# EasyEDA Pro project ProProject_WotageiStick.epro

# Schematic Schematic1
Create Date: 2023-12-16; Page Name: P1; Project Name: WotageiStick; Schematic Name: Schematic1; Update Date: 2024-01-03; Company: 嘉立创EDA; Page Size: A3; Version: V1.0
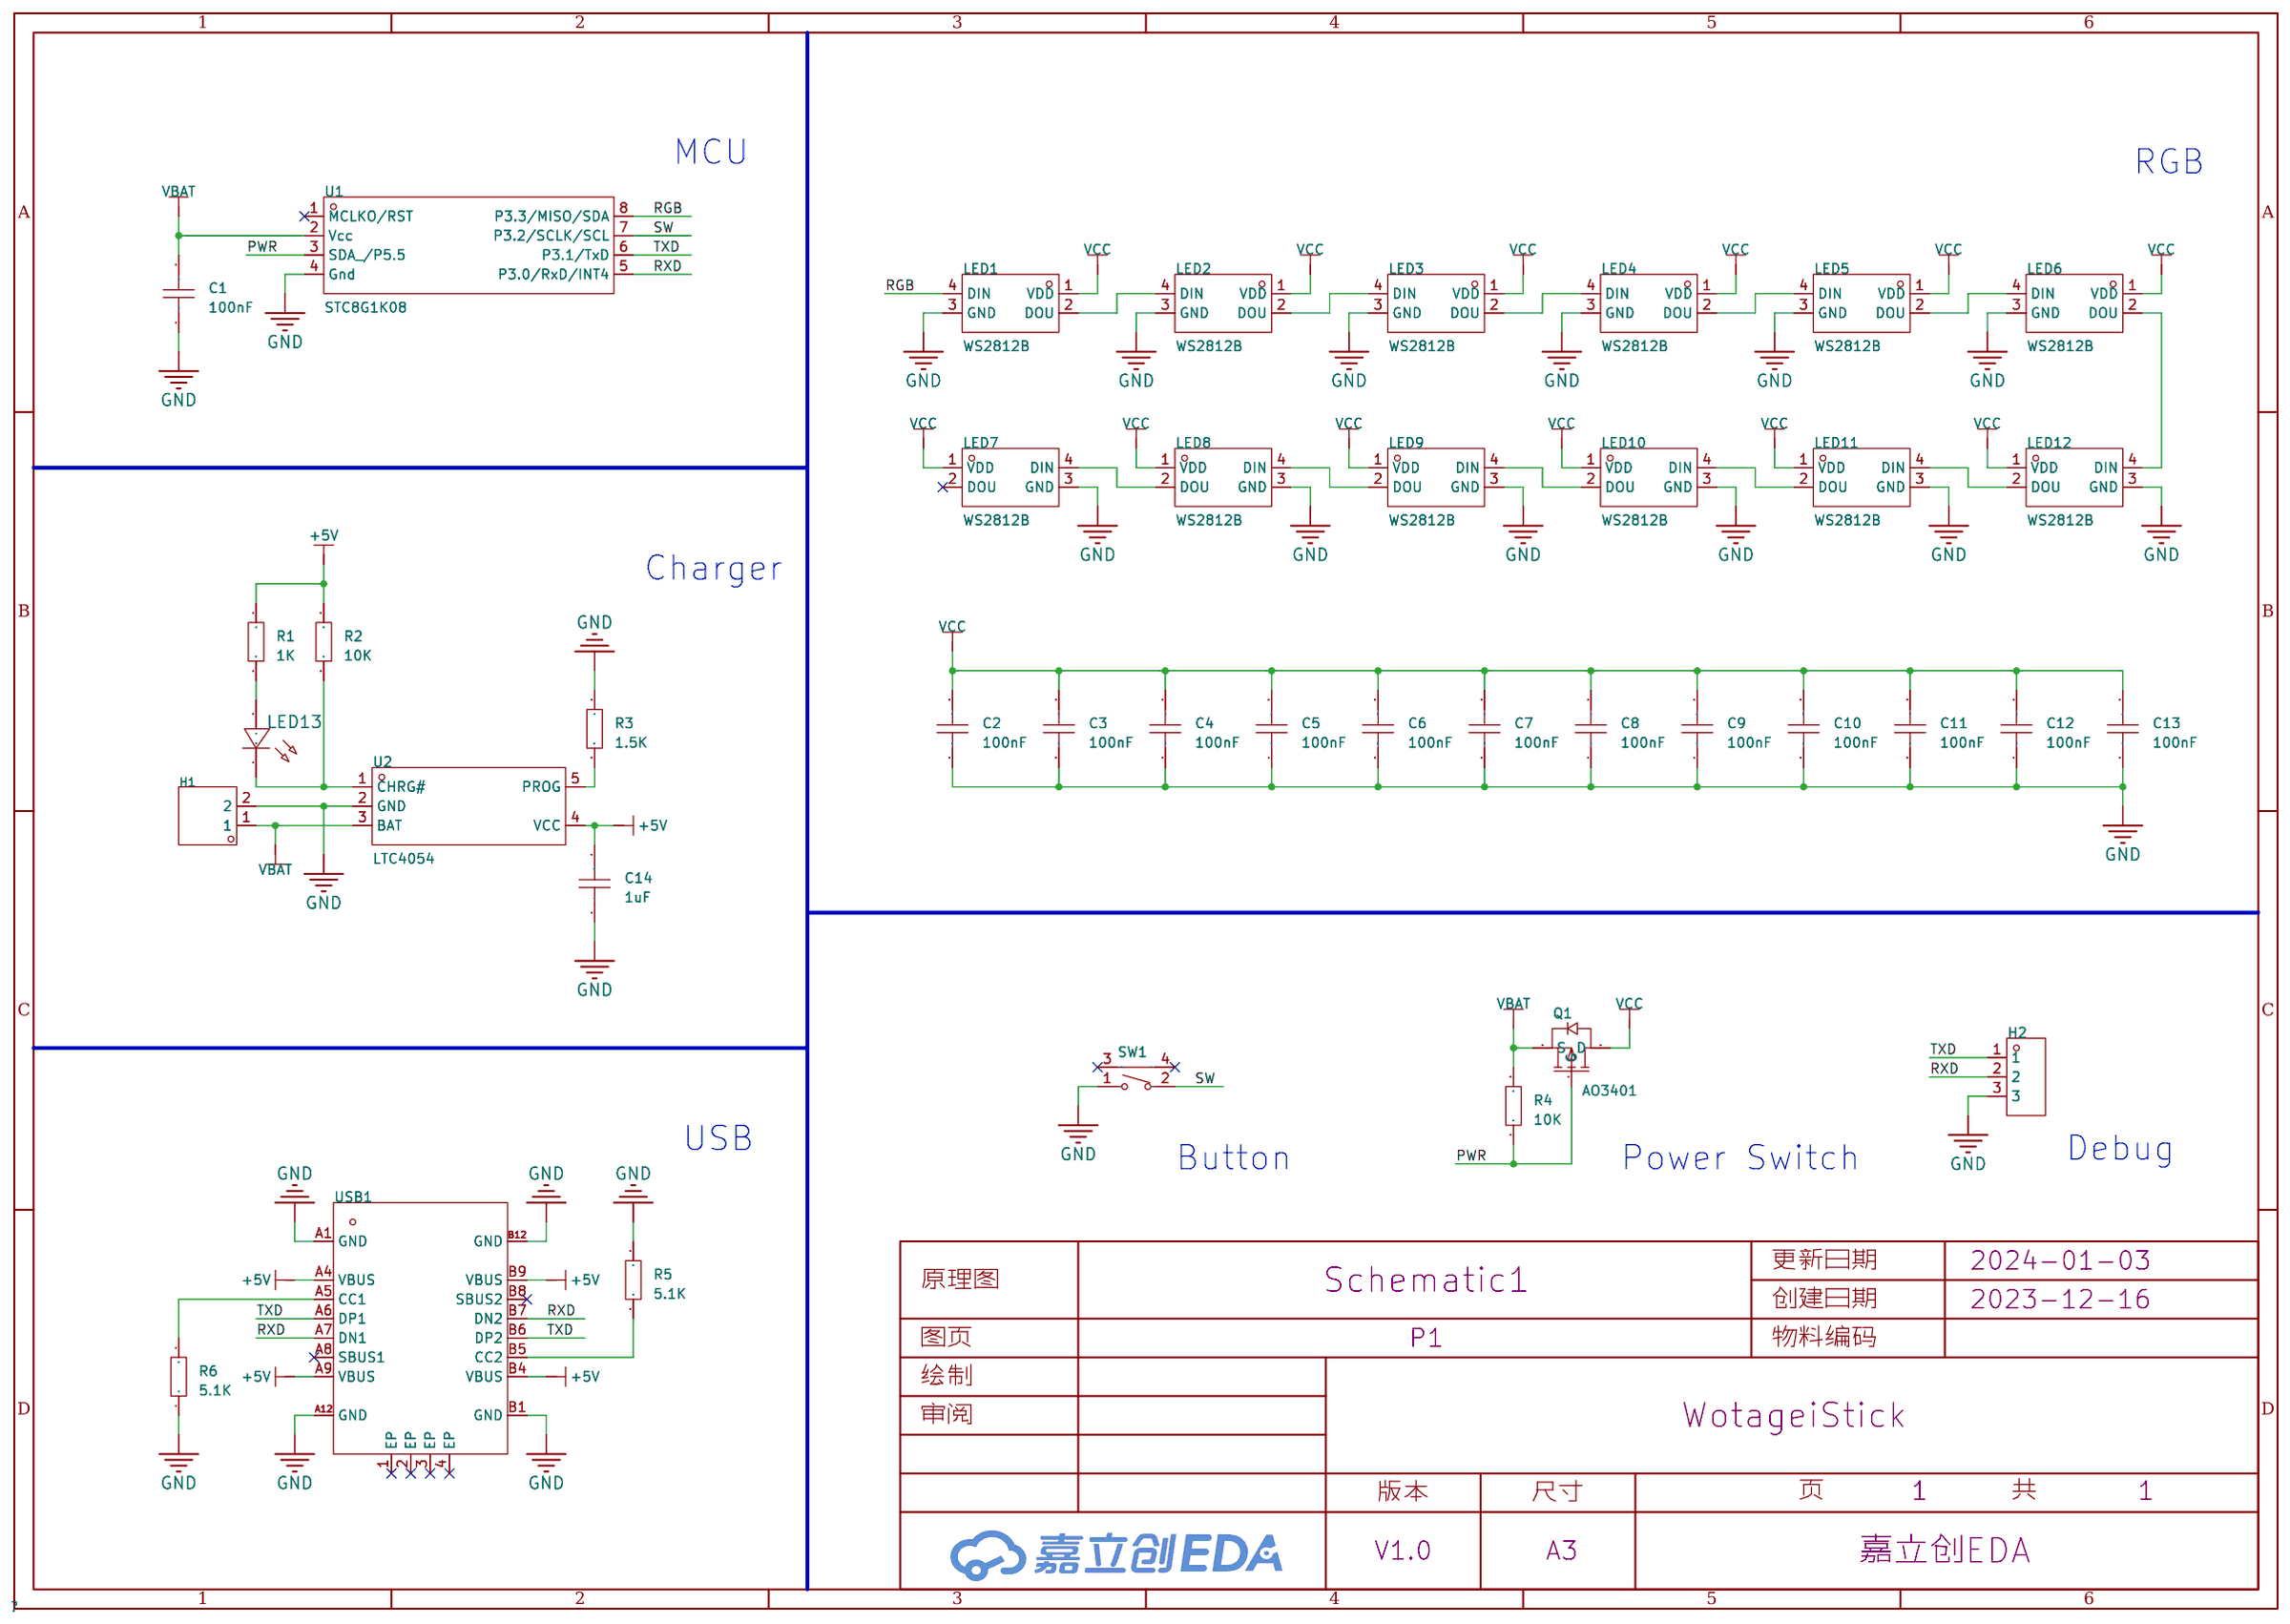
[diagram p0: schematic sheet]

## Parts
C1  100nF  [C0603]
C2  100nF  [C0603]
C3  100nF  [C0603]
C4  100nF  [C0603]
C5  100nF  [C0603]
C6  100nF  [C0603]
C7  100nF  [C0603]
C8  100nF  [C0603]
C9  100nF  [C0603]
C10  100nF  [C0603]
C11  100nF  [C0603]
C12  100nF  [C0603]
C13  100nF  [C0603]
C14  1uF  [C0603]
H1  -  [HDR-TH_2P-P2.54-V-M-1]
H2  -  [HDR-TH_3P-P2.54-V-M]
LED1  WS2812B  [LED-SMD_4P-L5.0-W5.0-BL_XL-5050RGBC]
LED2  WS2812B  [LED-SMD_4P-L5.0-W5.0-BL_XL-5050RGBC]
LED3  WS2812B  [LED-SMD_4P-L5.0-W5.0-BL_XL-5050RGBC]
LED4  WS2812B  [LED-SMD_4P-L5.0-W5.0-BL_XL-5050RGBC]
LED5  WS2812B  [LED-SMD_4P-L5.0-W5.0-BL_XL-5050RGBC]
LED6  WS2812B  [LED-SMD_4P-L5.0-W5.0-BL_XL-5050RGBC]
LED7  WS2812B  [LED-SMD_4P-L5.0-W5.0-BL_XL-5050RGBC]
LED8  WS2812B  [LED-SMD_4P-L5.0-W5.0-BL_XL-5050RGBC]
LED9  WS2812B  [LED-SMD_4P-L5.0-W5.0-BL_XL-5050RGBC]
LED10  WS2812B  [LED-SMD_4P-L5.0-W5.0-BL_XL-5050RGBC]
LED11  WS2812B  [LED-SMD_4P-L5.0-W5.0-BL_XL-5050RGBC]
LED12  WS2812B  [LED-SMD_4P-L5.0-W5.0-BL_XL-5050RGBC]
LED13  -  [LED_0603]
Q1  AO3401  [AO3401A_SOT-23-3]
R1  1K  [R0603]
R2  10K  [R0603]
R3  1.5K  [R0603]
R4  10K  [R0603]
R5  5.1K  [R0603]
R6  5.1K  [R0603]
SW1  TS-KG86E-ACT35F  [SW-SMD_TS-KG86EV-ART35]
U1  STC8G1K08  [SOP-8_L5.0-W4.0-P1.27-LS6.0-BL]
U2  LTC4054  [SOT-23-5_L3.0-W1.7-P0.95-LS2.8-BL]
USB1  -  [USB_TYPE-C-16P]

## Library data of the parts
C1-C14 = CAP_0603: Supplier Footprint: 0603
H1 = HDR-M_2.54_1x2P: Supplier Part: C124375; Supplier Footprint: 插件
H2 = HDR-M_2.54_1x3P: Supplier Part: C2937625; Supplier Footprint: 插件
LED1-LED12 = XL-5050RGBC-WS2812B: 发光颜色:RGB三色;二极管配置:-;功率:-;透镜颜色:无色透明透镜;主波长:-;色温:-;发光角度:120°;安装方式:正贴;工作温度:-30℃~+70℃;; LCSC Part Name: RGB三色 正贴 幻彩; Supplier Part: C2843785; Manufacturer: XINGLIGHT(成兴光); Supplier Footprint: SMD5050; JLCPCB Part Class: 扩展库; Datasheet: https://atta.szlcsc.com/upload/public/pdf/source/20230111/86AAD2096485A2E5BCAB883FF8CBE6FD.pdf; Supplier: LCSC; Emitted Color: RGB三色; Lens Color: 无色透明透镜; Peak Wavelength: 625nm；470nm；530nm; Viewing Angle: 120°; Mounting Sytle: 正贴; Operating Temperature: -30℃~+70℃
LED13 = LED_0603-R: Supplier Footprint: 0603
Q1 = AO3401A_P: Supplier Footprint: SOT-23-3L; Supplier Part: C15127
R1-R6 = Res_0603: Supplier Footprint: 0603
SW1 = TS-KG86E-ACT35F: 触点电流:50mA;额定电压(DC):12V;绝缘电阻:100MΩ;机械寿命:-;; LCSC Part Name: 侧按轻触开关2*4*3.5 迷你小型贴片按键开关; Supplier Part: C2874419; Manufacturer: HANBO(汉博); JLCPCB Part Class: 扩展库; Datasheet: https://atta.szlcsc.com/upload/public/pdf/source/20221110/7C8A71DCCE0191ED5ADB1ED6693AEFDE.pdf; Supplier: LCSC; Contact Current: 50mA; Voltage Rating (DC): 12V; Insulation Resistance: 100MΩ
U1 = STC8G1K08-36I-SOP8: CPU内核:51系列;CPU最大主频:-;程序存储容量:8KB;程序存储器类型:FLASH;GPIO端口数量:6;工作电压范围:1.9V~5.5V;RAM总容量:1.25KB;; Supplier Part: C713818; Manufacturer: STC(宏晶); Supplier Footprint: SOP-8; JLCPCB Part Class: 扩展库; Datasheet: https://atta.szlcsc.com/upload/public/pdf/source/20230914/7707908C45C6343AE73767C1466DDB8D.pdf; Supplier: LCSC; CPU Core: 51系列; Program Storage Size: 8KB; Program Memory Type: FLASH; GPIO Ports Number: 6; Operating Voltage Range: 1.9V~5.5V; RAM Size: 1.25KB; Operating Temperature Range: -40℃~+85℃; 16Bit Timer: 2; UART/USART: 1; I2C: 1; SPI: 1; Peripheral/Function: 低电压检测；看门狗；除法器；乘法器; Watchdog: 有; Low-Voltage Detect: 有; Internal Oscillator: 有
U2 = LTC4054ES5-4.2#PBF: 具有热调节功能的独立线性锂离子电池充电器; Supplier Part: C117064; Manufacturer: ADI(亚德诺)/LINEAR(凌特); Supplier Footprint: SOT-23-5; JLCPCB Part Class: 扩展库; Datasheet: https://atta.szlcsc.com/upload/public/pdf/source/20170712/C117064_1499832277334814248.pdf; Supplier: LCSC
USB1 = USB_TYPE-C-16P: Supplier Footprint: SMD

## Nets
+5V: C14.2 R1.1 R2.1 U2.4(VCC) USB1.A4(VBUS) USB1.A9(VBUS) USB1.B4(VBUS) USB1.B9(VBUS)
GND: C1.1 C2.1 C3.1 C4.1 C5.1 C6.1 C7.1 C8.1 C9.1 C10.1 C11.1 C12.1 C13.1 C14.1 H1.2 H2.3 LED1.3(GND) LED2.3(GND) LED3.3(GND) LED4.3(GND) LED5.3(GND) LED6.3(GND) LED7.3(GND) LED8.3(GND) LED9.3(GND) LED10.3(GND) LED11.3(GND) LED12.3(GND) R3.1 R5.1 R6.1 SW1.1 U1.4(Gnd) U2.2(GND) USB1.A1(GND) USB1.A12(GND) USB1.B1(GND) USB1.B12(GND)
VBAT: C1.2 H1.1 Q1.2(S) R4.2 U1.2(Vcc) U2.3(BAT)
VCC: C2.2 C3.2 C4.2 C5.2 C6.2 C7.2 C8.2 C9.2 C10.2 C11.2 C12.2 C13.2 LED1.1(VDD) LED2.1(VDD) LED3.1(VDD) LED4.1(VDD) LED5.1(VDD) LED6.1(VDD) LED7.1(VDD) LED8.1(VDD) LED9.1(VDD) LED10.1(VDD) LED11.1(VDD) LED12.1(VDD) Q1.3(D)
PWR: Q1.1(G) R4.1 U1.3(SDA_/P5.5)
RGB: LED1.4(DIN) U1.8(P3.3/MISO/SDA)
RXD: H2.2 U1.5(P3.0/RxD/INT4) USB1.A7(DN1) USB1.B7(DN2)
SW: SW1.2 U1.7(P3.2/SCLK/SCL)
TXD: H2.1 U1.6(P3.1/TxD) USB1.A6(DP1) USB1.B6(DP2)
$1N498: R3.2 U2.5(PROG)
$1N559: LED13.2(A) R1.2
$1N577: LED13.1(C) R2.2 U2.1(CHRG#)
$1N1367: LED4.2(DOU) LED5.4(DIN)
$1N1526: LED2.2(DOU) LED3.4(DIN)
$1N1539: LED3.2(DOU) LED4.4(DIN)
$1N1823: LED8.4(DIN) LED9.2(DOU)
$1N1839: LED10.4(DIN) LED11.2(DOU)
$1N1846: LED9.4(DIN) LED10.2(DOU)
$1N1960: LED1.2(DOU) LED2.4(DIN)
$1N2043: LED7.4(DIN) LED8.2(DOU)
$1N3699: R6.2 USB1.A5(CC1)
$1N3708: R5.2 USB1.B5(CC2)
$1N6521: LED5.2(DOU) LED6.4(DIN)
$1N6607: LED6.2(DOU) LED12.4(DIN)
$1N6709: LED11.4(DIN) LED12.2(DOU)

Not connected (* = marked no-connect by the designer): LED7 2(DOU)*; SW1 3* 4*; U1 1(MCLKO/RST)*; USB1 1(EP)* 2(EP)* 3(EP)* 4(EP)* A8(SBUS1)* B8(SBUS2)*

## Notes on the sheet
- MCU
- RGB
- Charger
- USB
- Debug
- Button
- Power Switch

# Schematic Schematic2
Create Date: 2023-12-17; Page Name: P1; Project Name: WotageiStick; Schematic Name: Schematic2; Update Date: 2023-12-18; Company: 嘉立创EDA; Page Size: A3; Version: V1.0
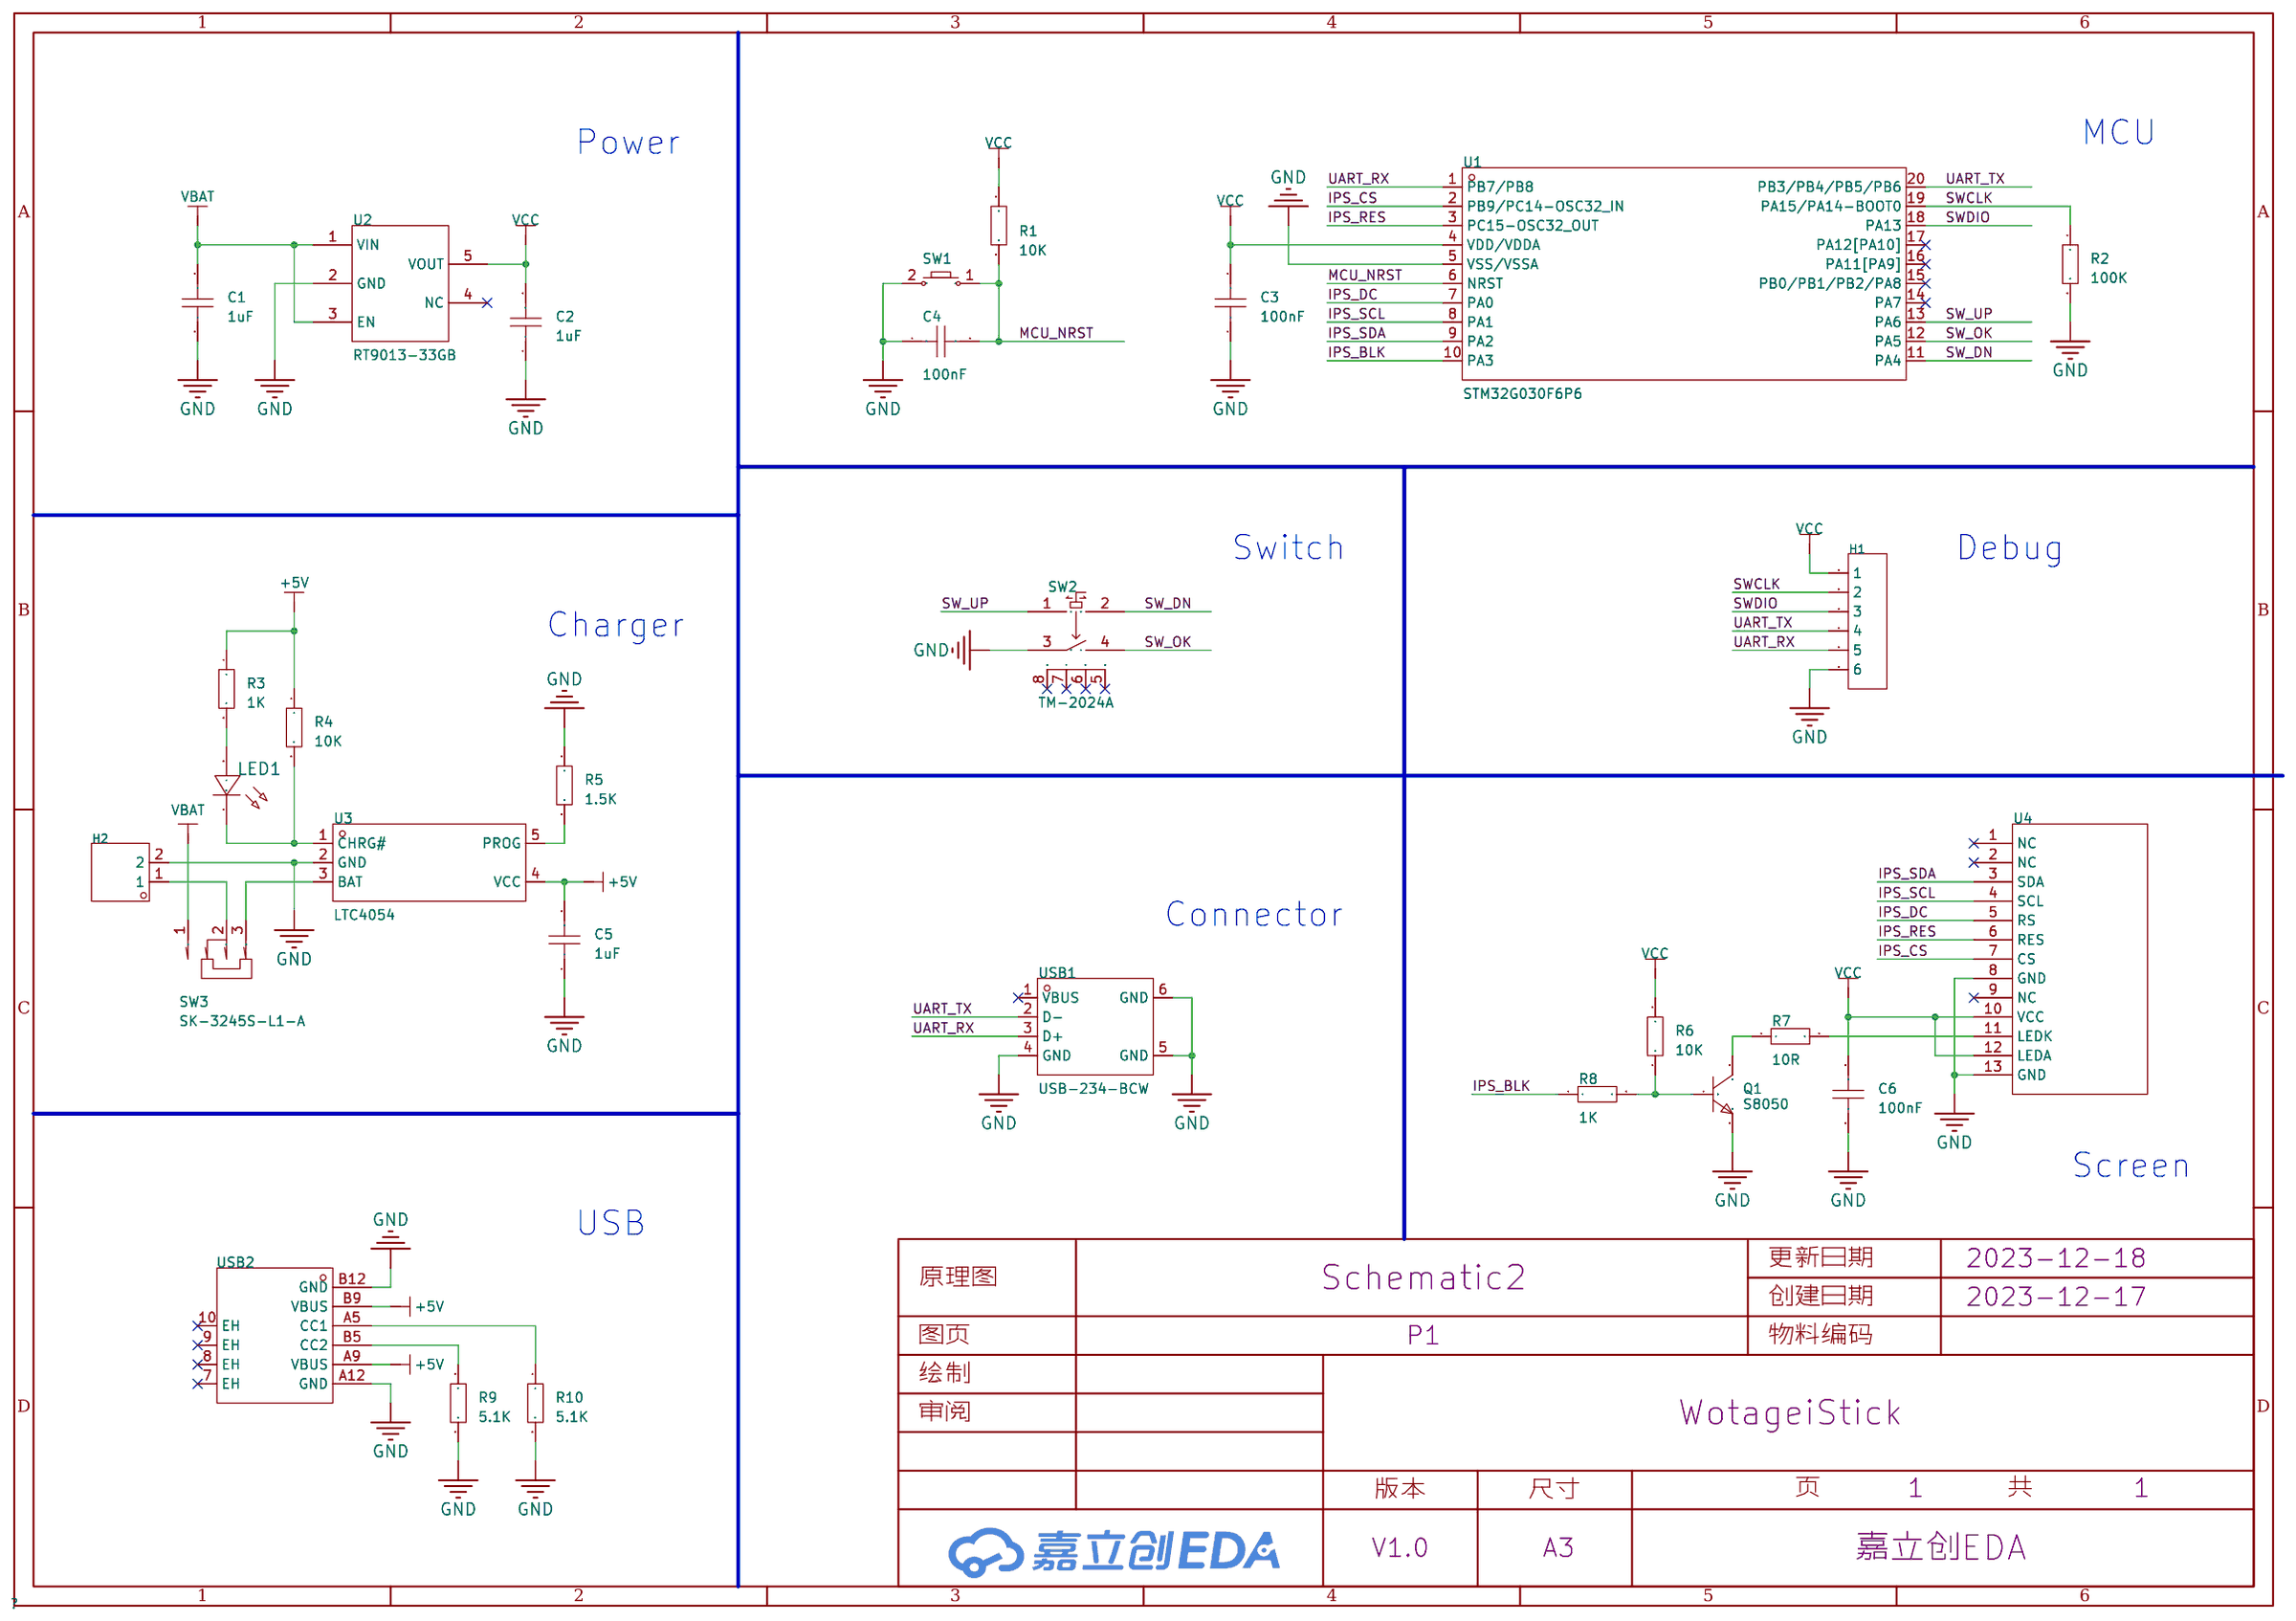
[diagram p1: schematic sheet]

## Parts
C1  1uF  [C0603]
C2  1uF  [C0603]
C3  100nF  [C0603]
C4  100nF  [C0603]
C5  1uF  [C0603]
C6  100nF  [C0603]
H1  -  [HDR-TH_6P-P2.54-V-M-1]
H2  -  [HDR-TH_2P-P2.54-V-M-1]
LED1  -  [LED_0603]
Q1  S8050  [SOT-23-3_L2.9-W1.3-P1.90-LS2.4-BR]
R1  10K  [R0603]
R2  100K  [R0603]
R3  1K  [R0603]
R4  10K  [R0603]
R5  1.5K  [R0603]
R6  10K  [R0603]
R7  10R  [R0603]
R8  1K  [R0603]
R9  5.1K  [R0603]
R10  5.1K  [R0603]
SW1  -  [Key_SMD_3x4x2]
SW2  TM-2024A  [SW-SMD_TM-2024A]
SW3  SK-3245S-L1-A  [SW-SMD_SK-3245S-L1-A-1]
U1  STM32G030F6P6  [TSSOP-20_L6.5-W4.4-P0.65-LS6.4-BL]
U2  RT9013-33GB  [SOT-23-5_L3.0-W1.7-P0.95-LS2.8-BL]
U3  LTC4054  [SOT-23-5_L3.0-W1.7-P0.95-LS2.8-BL]
U4  -  [N096-1608TBBIG11-H13]
USB1  USB-234-BCW  [USB-A-SMD_USB-234-BCW]
USB2  -  [USB_ TYPE-C-6P]

## Library data of the parts
C1-C6 = CAP_0603: Supplier Footprint: 0603
H1 = HDR-M_2.54_1x6P: Supplier Part: C37208; Supplier Footprint: 插件
H2 = HDR-M_2.54_1x2P: Supplier Part: C124375; Supplier Footprint: 插件
LED1 = LED_0603-R: Supplier Footprint: 0603
Q1 = S8050_C2891804: 晶体管类型:NPN;集电极电流(Ic):500mA;集射极击穿电压(Vceo):25V;功率(Pd):300mW;; LCSC Part Name: 耐压:25V 电流:500mA NPN; Supplier Part: C2891804; Manufacturer: YONGYUTAI(永裕泰); Supplier Footprint: SOT-23; JLCPCB Part Class: Extended Part; Datasheet: https://atta.szlcsc.com/upload/public/pdf/source/20210901/5347316A10609C628D4D69AE01446E5B.pdf; Supplier: LCSC; Transistor Type: NPN; Collector Current (Ic): 500mA; Collector-Emitter Breakdown Voltage (Vceo): 25V; Power Dissipation (Pd): 300mW; Collector Cut-Off Current (Icbo): 1uA; Collector-Emitter Saturation Voltage (VCE(sat)@Ic,Ib): 500mV@500mA,50mA; Operating Temperature: +150℃@(Tj)
R1-R10 = Res_0603: Supplier Footprint: 0603
SW1 = Key_SMD_3x4x2: Supplier Footprint: SMD
SW2 = TM-2024A: LCSC Part Name: 四脚两档拨轮开关TM-2024A; Supplier Part: C561480; Manufacturer: XKB Connectivity(中国星坤); Supplier Footprint: SMD; JLCPCB Part Class: 扩展库; Datasheet: https://atta.szlcsc.com/upload/public/pdf/source/20211011/7A4DB3DC37E7D5823B6D92C66ED3191E.pdf; Supplier: LCSC
SW3 = SK-3245S-L1-A: 电路结构:双刀双掷;安装方式:卧贴;开关颜色:黑色;额定电流(DC):50mA;额定电压(DC):12V;额定电流(AC):50mA;额定电压(AC):12V;机械寿命:1万次;; LCSC Part Name: 柄长2mm 卧贴双档 滑动开关; Supplier Part: C405951; Manufacturer: XKB Connectivity(中国星坤); Supplier Footprint: SMD; JLCPCB Part Class: 扩展库; Datasheet: https://atta.szlcsc.com/upload/public/pdf/source/20200227/C405951_CBAB505F81ACCB08512C6DA919ADD92C.pdf; Supplier: LCSC; Circuit: 双刀双掷; Actuator Style: 矩形柱状; Pin Style: SMD接片; Switch Length: 9.1mm; Switch Width: 3.55mm; Switch Height: 3.2mm; Mounting Style: 卧贴; Actuator Color: 黑色; Current Rating (DC): 50mA; Voltage Rating (DC): 12V; Current Rating (AC): 50mA; Voltage Rating (AC): 12V; Mechanical Life: 1万次; Operating Temperature: -40℃~+85℃
U1 = STM32G030F6P6: Supplier Part: C724040; Manufacturer: ST(意法半导体); Supplier Footprint: TSSOP-20; JLCPCB Part Class: 扩展库; Datasheet: https://atta.szlcsc.com/upload/public/pdf/source/20200511/C529329_A1CB615556C746C4EA827FCAD1461480.pdf; Supplier: LCSC
U2 = RT9013-33GB: 输出类型:固定;输出极性:正;最大输入电压:5.5V;输出电压:3.3V;输出电流:500mA;电源纹波抑制比(PSRR):50dB@(10kHz);; LCSC Part Name: 输入5.5V 输出3.3V 500mA; Supplier Part: C47773; Manufacturer: RICHTEK(立锜); Supplier Footprint: SOT-23-5; JLCPCB Part Class: 扩展库; Datasheet: https://atta.szlcsc.com/upload/public/pdf/source/20150504/1457707282459.pdf; Supplier: LCSC; Output Type: 固定; Output Polarity: 正; Number of Outputs: 1; Maximum Input Voltage: 5.5V; Output Voltage: 3.3V; Dropout Voltage: 400mV@(500mA); Quiescent Current (Ground Current): 50uA; Output Current: 500mA; Power Supply Rejection Ratio (PSRR): 50dB@(10kHz); Operating Temperature: -40℃~+85℃
U3 = LTC4054ES5-4.2#PBF: 具有热调节功能的独立线性锂离子电池充电器; Supplier Part: C117064; Manufacturer: ADI(亚德诺)/LINEAR(凌特); Supplier Footprint: SOT-23-5; JLCPCB Part Class: 扩展库; Datasheet: https://atta.szlcsc.com/upload/public/pdf/source/20170712/C117064_1499832277334814248.pdf; Supplier: LCSC
U4 = TFT显示模块 0.96寸TFT 13PIN ST7735S
USB1 = USB-234-BCW: 连接器类型:Type-A;标准:USB 2.0;公母:母;端口数量:1;触点数量:4P;安装方式:卧贴;额定电流 - 电源:1.5A;工作温度范围:-20℃~+70℃;焊接温度(最大值):260℃;; LCSC Part Name: Type-A 母 卧贴; Supplier Part: C720528; Manufacturer: XUNPU(讯普); Supplier Footprint: SMD; JLCPCB Part Class: Extended Part; Datasheet: https://atta.szlcsc.com/upload/public/pdf/source/20200810/C720528_E4736DAF0BDC0C92527D8BAAAC86B8A5.pdf; Supplier: LCSC; Connector Type: Type-A; Standard: USB 2.0; Gender: 母; Number of Ports: 1; Number of Contacts: 4P; Mounting Style: 卧贴; Current Rating - Power (Max): 1.5A; Operating Temperature Range: -20℃~+70℃; Welding Temperature (Max): 260℃
USB2 = USB_ Type-C-6P: Supplier Footprint: SMD

## Nets
+5V: C5.2 R3.1 R4.1 U3.4(VCC) USB2.A9(VBUS) USB2.B9(VBUS)
GND: C1.1 C2.1 C3.1 C4.1 C5.1 C6.1 H1.6 H2.2 Q1.2(E) R2.2 R5.1 R9.1 R10.2 SW1.2 SW2.3 U1.5(VSS/VSSA) U2.2(GND) U3.2(GND) U4.8(GND) U4.13(GND) USB1.4(GND) USB1.5(GND) USB1.6(GND) USB2.A12(GND) USB2.B12(GND)
VBAT: C1.2 SW3.1 U2.1(VIN) U2.3(EN)
VCC: C2.2 C3.2 C6.2 H1.1 R1.1 R6.2 U1.4(VDD/VDDA) U2.5(VOUT) U4.10(VCC) U4.12(LEDA)
IPS_BLK: R8.1 U1.10(PA3)
IPS_CS: U1.2(PB9/PC14-OSC32_IN) U4.7(CS)
IPS_DC: U1.7(PA0) U4.5(RS)
IPS_RES: U1.3(PC15-OSC32_OUT) U4.6(RES)
IPS_SCL: U1.8(PA1) U4.4(SCL)
IPS_SDA: U1.9(PA2) U4.3(SDA)
MCU_NRST: C4.2 R1.2 SW1.1 U1.6(NRST)
SW_DN: SW2.2 U1.11(PA4)
SW_OK: SW2.4 U1.12(PA5)
SW_UP: SW2.1 U1.13(PA6)
SWCLK: H1.2 R2.1 U1.19(PA15/PA14-BOOT0)
SWDIO: H1.3 U1.18(PA13)
UART_RX: H1.5 U1.1(PB7/PB8) USB1.3(D+)
UART_TX: H1.4 U1.20(PB3/PB4/PB5/PB6) USB1.2(D-)
$1N438: Q1.3(C) R7.1
$1N441: R7.2 U4.11(LEDK)
$1N3309: Q1.1(B) R6.1 R8.2
$1N4191: R9.2 USB2.B5(CC2)
$1N4196: R10.1 USB2.A5(CC1)
$1N5747: SW3.3 U3.3(BAT)
$1N5751: R5.2 U3.5(PROG)
$1N5752: LED1.2(A) R3.2
$1N5753: LED1.1(C) R4.2 U3.1(CHRG#)
$1N5756: H2.1 SW3.2

Not connected (* = marked no-connect by the designer): SW2 5* 6* 7* 8*; U1 14(PA7)* 15(PB0/PB1/PB2/PA8)* 16(PA11[PA9])* 17(PA12[PA10])*; U2 4(NC)*; U4 1(NC)* 2(NC)* 9(NC)*; USB1 1(VBUS)*; USB2 7(EH)* 8(EH)* 9(EH)* 10(EH)*

## Notes on the sheet
- Power
- MCU
- Switch
- Debug
- Charger
- Connector
- Screen
- USB

# Board PCB1
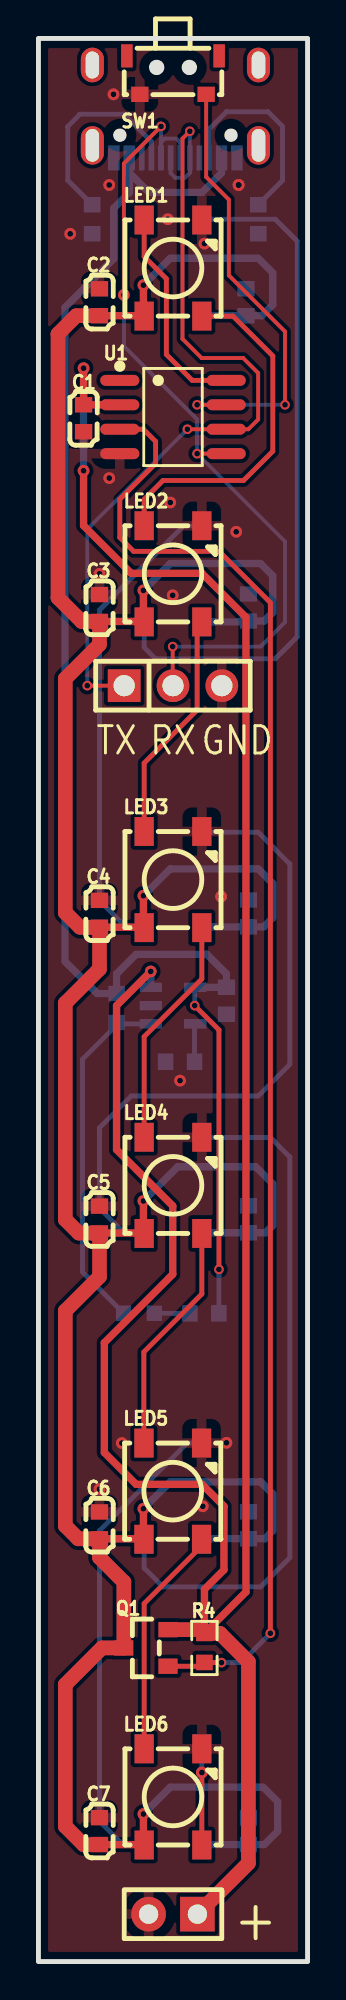
[diagram p2: board, top side]
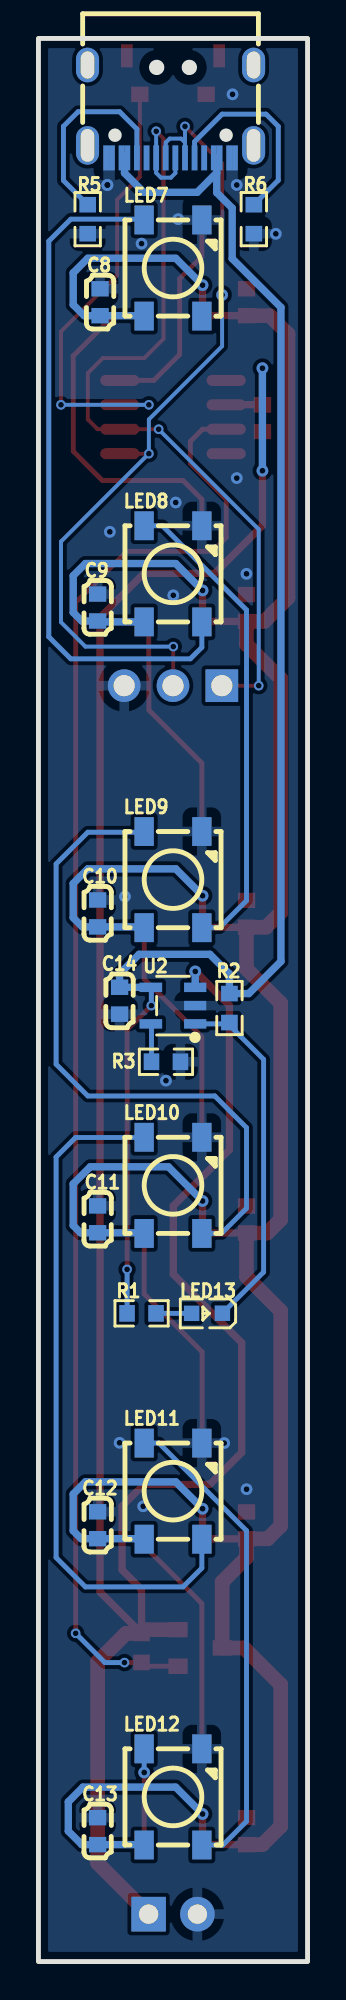
[diagram p3: board, bottom side, seen from below]

Outline 14 x 100 mm; copper layers: Top Layer, Bottom Layer. Coordinates in mm from the lower left corner of the outline.
Outline path: rectangle 0,100 14,0
Stack: Top Layer 0.035mm / Dielectric1 1.51mm FR4 er 4.5 / Bottom Layer 0.035mm

## Design rules (mm)
template: JLCPCB Capability(Two Layers Board)
spacing copperThickness1oz (default): track to track 0.102, other pairs 0.152 to 0.3
spacing copperThickness2oz: track to track 0.203, other pairs 0.152 to 0.3
track width copperThickness1oz (default): min 0.127, default 0.254, max 2.54
track width copperThickness2oz: min 0.203, default 0.254, max 2.54
differential pair differentialPair (default): width min 0.127, default 0.254, max 2.54; gap min 0.152, default 0.152
via viaSize (default): diameter min 0.5, default 0.61, max 10; hole min 0.3, default 0.305, max 6.3

## Placement (name value [footprint] x y rotation side)
C1  100nF  [C0603]  2.35 80.25 90 top
C2  100nF  [C0603]  3.18 86.28 270 top
C3  100nF  [C0603]  3.18 70.38 270 top
C4  100nF  [C0603]  3.18 54.48 270 top
C5  100nF  [C0603]  3.18 38.58 270 top
C6  100nF  [C0603]  3.18 22.68 270 top
C7  100nF  [C0603]  3.18 6.78 270 top
C8  100nF  [C0603]  10.79 86.28 270 bottom
C9  100nF  [C0603]  10.92 70.41 270 bottom
C10  100nF  [C0603]  10.92 54.5 270 bottom
C11  100nF  [C0603]  10.92 38.6 270 bottom
C12  100nF  [C0603]  10.92 22.69 270 bottom
C13  100nF  [C0603]  10.92 6.78 270 bottom
C14  1uF  [C0603]  9.78 49.96 90 bottom
H1  -  [HDR-TH_2P-P2.54-V-M-1]  7 2.46 180 top
H2  -  [HDR-TH_3P-P2.54-V-M]  7 66.34 0 top
LED1  WS2812B  [LED-SMD_4P-L5.0-W5.0-BL_XL-5050RGBC]  7 88.06 0 top
LED2  WS2812B  [LED-SMD_4P-L5.0-W5.0-BL_XL-5050RGBC]  7 72.16 0 top
LED3  WS2812B  [LED-SMD_4P-L5.0-W5.0-BL_XL-5050RGBC]  7 56.26 0 top
LED4  WS2812B  [LED-SMD_4P-L5.0-W5.0-BL_XL-5050RGBC]  7 40.36 0 top
LED5  WS2812B  [LED-SMD_4P-L5.0-W5.0-BL_XL-5050RGBC]  6.99 24.46 0 top
LED6  WS2812B  [LED-SMD_4P-L5.0-W5.0-BL_XL-5050RGBC]  7 8.56 0 top
LED7  WS2812B  [LED-SMD_4P-L5.0-W5.0-BL_XL-5050RGBC]  7 88.06 180 bottom
LED8  WS2812B  [LED-SMD_4P-L5.0-W5.0-BL_XL-5050RGBC]  7 72.16 180 bottom
LED9  WS2812B  [LED-SMD_4P-L5.0-W5.0-BL_XL-5050RGBC]  7 56.26 180 bottom
LED10  WS2812B  [LED-SMD_4P-L5.0-W5.0-BL_XL-5050RGBC]  7 40.36 180 bottom
LED11  WS2812B  [LED-SMD_4P-L5.0-W5.0-BL_XL-5050RGBC]  7 24.46 180 bottom
LED12  WS2812B  [LED-SMD_4P-L5.0-W5.0-BL_XL-5050RGBC]  7 8.56 180 bottom
LED13  -  [LED_0603]  5.28 33.7 0 bottom
Q1  AO3401  [AO3401A_SOT-23-3]  5.59 16.31 0 top
R1  1K  [R0603]  8.64 33.71 180 bottom
R2  10K  [R0603]  4.06 49.58 270 bottom
R3  1.5K  [R0603]  7.37 46.79 0 bottom
R4  10K  [R0603]  8.64 16.31 90 top
R5  5.1K  [R0603]  11.44 90.6 90 bottom
R6  5.1K  [R0603]  2.79 90.6 90 bottom
SW1  TS-KG86E-ACT35F  [SW-SMD_TS-KG86EV-ART35]  7 98.09 0 top
U1  STC8G1K08  [SOP-8_L5.0-W4.0-P1.27-LS6.0-BL]  7 80.31 270 top
U2  LTC4054  [SOT-23-5_L3.0-W1.7-P0.95-LS2.8-BL]  7 49.71 90 bottom
USB1  -  [USB_TYPE-C-16P]  7 96.2 0 bottom

## Footprints (pads in the part's own frame, mm; a bottom-side part is the same pattern mirrored in y, then rotated)
AO3401A_SOT-23-3
  rect 1x0.8 smd: 1(1.15,-0.95) 2(1.15,0.95) 3(-1.15,0)
C0603
  rect 0.8x0.9 smd: 1(-0.7,0) 2(0.7,0)
HDR-TH_2P-P2.54-V-M-1
  rect 1.8x1.8 hole 1: 1(-1.27,0)
  round 1.8 hole 1: 2(1.27,0)
HDR-TH_3P-P2.54-V-M
  rect 1.7x1.7 hole 1.1: 1(-2.54,0)
  round 1.7 hole 1.1: 2(0,0) 3(2.54,0)
LED-SMD_4P-L5.0-W5.0-BL_XL-5050RGBC
  rect 1x1.5 smd: 1(-1.5,-2.5) 2(1.5,-2.5) 3(1.5,2.5) 4(-1.5,2.5)
LED_0603
  rect 0.8x0.8 smd: 1(-0.851,-0.01) 2(0.75,-0.005)
R0603
  rect 0.806x0.864 smd: 1(-0.753,0) 2(0.753,0)
SOP-8_L5.0-W4.0-P1.27-LS6.0-BL
  oval 0.574x2.035 smd: 1(-1.905,-2.768) 2(-0.635,-2.768) 3(0.635,-2.768) 4(1.905,-2.768) 5(1.905,2.768) 6(0.635,2.768) 7(-0.635,2.768) 8(-1.905,2.768)
SOT-23-5_L3.0-W1.7-P0.95-LS2.8-BL
  rect 0.49x1.157 smd: 1(-0.95,-1.153) 2(0,-1.153) 3(0.95,-1.153)
  rect 0.49x1.175 smd: 4(0.95,1.153) 5(-0.95,1.153)
SW-SMD_TS-KG86EV-ART35
  rect 0.9x0.8 smd: 1(-1.725,-1) 2(1.725,-1)
  rect 0.6x1.2 smd: 3(-2.4,1) 4(2.4,1)
USB_TYPE-C-16P
  oval 1.2x2 hole 0.7x1.7: 1(-4.193,1.765) 2(4.447,1.765)
  oval 1.2x1.8 hole 0.7x1.4: 3(-4.193,-2.415) 4(4.447,-2.415)
  rect 0.3x1.3 smd: A1(-3.223,2.415) A4(-2.423,2.415) A5(-1.123,2.415) A6(-0.123,2.415) A7(0.377,2.415) A8(1.377,2.415) A9(2.677,2.415) A12(3.477,2.415) B1(3.177,2.415) B4(2.377,2.415) B5(1.877,2.415) B6(0.877,2.415) B7(-0.623,2.415) B8(-1.623,2.415) B9(-2.123,2.415) B12(-2.923,2.415)

## Nets
As in the schematic.

Pads without a net: LED7 2; SW1 3 4; U1 1; USB1 1 2 3 4 A8 B8

## Via types
v1: diameter 0.61, hole 0.305, Top Layer to Bottom Layer, 29 vias
v2: diameter 0.5, hole 0.3, Top Layer to Bottom Layer, 12 vias

## Routing (per net, layer and track width the routed paths; a pad name or vN(x,y) marks a point on that pad's centre or on a via; arc(x,y) is an arc through that point)
+5V: length 80.5
  Top Layer w0.254: v2(9.39,35.99) 9.39,48.45 v2(8.13,49.71)
  Bottom Layer w0.254: R1.1 v2(9.39,35.99) ; U2.4 8.13,50.63 v2(8.13,49.71)
  Bottom Layer w0.381: 4.73,93.29 4.73,93.81 ; 4.73,93.29 4.72,93.29 ; 4.73,93.29 4.73,93.02 ; 4.73,93.02 4.73,91.98 3.92,91.18 3.92,88.55 1.38,86.02 1.38,52.01 3.06,50.33 R2.1 4.06,51.36 5.08,52.38 8.76,52.38 9.78,51.36 C14.2 9.78,50.66 U2.4 ; 4.73,93.02 5.74,92 8.52,92 9.52,93 9.52,93.9
GND:
  vias: v1(1.65,89.84) v1(3.18,72.16) v1(3.18,24.56) v1(3.68,92.38) v1(3.68,77.14) v1(3.9,97.09) v1(4.34,26.96) v1(6.73,90.6) v1(6.86,75.87) v1(6.99,71.04) v1(7.37,45.81) v1(8.64,89.33) v1(8.55,23.67) v1(9.5,55.38) v1(9.78,26.97) v1(10.29,74.35) v1(10.41,92.38) v1(10.41,92.38)
VBAT: length 138.9
  Top Layer w0.381: v1(2.35,82.86) C1.2 4.23,80.95 U1.2 ; v1(5.84,51.49) 4.06,49.71 4.06,42.22 6.99,39.29 6.99,35.74 3.43,32.18 3.43,26.47 5.08,24.82 8.51,24.82 9.65,23.67 9.65,20.37 8.64,19.35 R4.2 10.79,19.22 10.79,69.9 8.51,72.19 4.83,72.19 2.35,74.67 v1(2.35,77.52)
  Top Layer w0.762: H1.1 10.92,5.12 10.92,15.59 9.45,17.06 R4.2 8.44,17.26 Q1.2
  Bottom Layer w0.381: v1(2.35,77.52) v1(2.35,82.86) ; v1(5.84,51.49) 5.84,50.66 U2.3
VCC: length 197
  Top Layer w0.381: v1(5.46,55.42) 5.46,53.8 5.48,53.78 ; C7.2 5.48,6.08 ; 5.48,6.08 5.46,6.1 v1(5.46,7.67) ; 5.48,6.08 LED6.1 ; C4.2 5.48,53.78 ; 5.48,53.78 LED3.1 ; C3.2 5.48,69.68 ; 5.48,69.68 5.46,69.7 v1(5.46,71.3) ; 5.48,69.68 LED2.1 ; 5.48,85.58 5.46,85.6 v1(5.46,87.17) ; 5.48,85.58 C2.2 ; 5.48,85.58 LED1.1 ; 5.48,37.88 LED4.1 ; 5.48,37.88 C5.2 ; 5.48,37.88 5.46,37.9 v1(5.46,39.55) ; C6.2 5.46,21.98 ; 5.46,21.98 LED5.1 ; 5.46,21.98 5.46,23.54 v1(5.46,23.55)
  Top Layer w0.762: C2.2 1.97,85.58 1.02,84.63 1.02,70.92 2.25,69.68 C3.2 3.18,68.49 1.4,66.71 1.4,54.55 2.16,53.78 C4.2 3.18,51.61 1.4,49.83 1.4,38.58 2.1,37.88 C5.2 3.18,35.61 1.4,33.83 1.4,22.66 2.07,21.98 C6.2 3.18,21.01 4.44,19.74 4.44,16.31 Q1.3 3.3,16.31 1.4,14.4 1.4,7.03 2.34,6.08 C7.2
  Bottom Layer w0.381: v1(5.46,23.55) 6.86,24.94 11.56,24.94 12.19,24.31 12.19,22.4 11.78,21.99 C12.2 8.53,21.99 LED11.1 ; LED12.1 8.52,6.08 C13.2 11.75,6.08 12.45,6.78 12.45,8.31 11.68,9.07 6.86,9.07 v1(5.46,7.67) ; v1(5.46,87.17) 6.86,88.57 11.43,88.57 12.19,87.81 12.19,86.16 11.62,85.58 C8.2 8.52,85.58 LED7.1 ; LED9.1 8.54,53.8 C10.2 11.71,53.8 12.19,54.28 12.19,56.06 11.43,56.82 6.86,56.82 v1(5.46,55.42) ; LED10.1 8.53,37.9 C11.2 11.81,37.9 12.19,38.28 12.19,40.44 11.3,41.33 7.24,41.33 v1(5.46,39.55) ; LED8.1 10.87,69.66 C9.2 11.75,69.71 12.19,70.16 12.19,72.06 11.56,72.69 6.86,72.69 v1(5.46,71.3)
PWR: length 76.8
  Top Layer w0.254: U1.3 5.46,79.68 6.1,79.05 6.1,77.9 4.23,76.04 4.23,74.05 4.95,73.33 9.4,73.33 12.06,70.66 v2(12.06,17.07) ; v2(9.53,15.54) 8.64,15.54 R4.1 8.44,15.36 Q1.1
  Bottom Layer w0.254: v2(9.53,15.54) 10.54,15.54 v2(12.06,17.07)
RGB: length 11.1
  Top Layer w0.254: LED1.4 5.5,88.66 6.66,87.5 6.66,83.57 8,82.22 U1.8
RXD: length 43.6
  Top Layer w0.203: v1(4.44,86.67) 4.44,93.5 v2(6.38,95.43) ; v2(8.25,78.41) U1.5 ; H2.2 6.99,66.36 v2(6.99,68.38)
  Bottom Layer w0.203: 6.38,94.59 6.58,94.79 7.17,94.79 7.38,94.59 USB1.A7 ; 6.38,94.59 v2(6.38,95.43) ; 6.38,94.59 USB1.B7 ; v2(6.99,68.38) 11.56,68.38 12.83,69.65 12.83,73.84 v2(8.25,78.41) 8.25,80.19 4.44,84 v1(4.44,86.67)
SW: length 23.9
  Top Layer w0.203: v2(12.83,80.95) 12.83,84.76 9.91,87.68 9.91,91.62 8.72,92.8 SW1.2 ; v2(8.25,80.95) U1.7
  Bottom Layer w0.203: v2(8.25,80.95) v2(12.83,80.95)
TXD: length 43.5
  Top Layer w0.203: v2(7.87,95.17) 7.49,94.79 7.49,84.38 8.49,83.38 10.65,83.38 11.43,82.6 11.43,80.19 10.92,79.68 U1.6 v2(7.75,79.68) ; v2(2.54,66.34) H2.1
  Bottom Layer w0.203: v2(2.54,66.34) 2.54,74.47 v2(7.75,79.68) ; v2(7.87,95.17) 7.88,95.17 USB1.B6 7.88,93.01 7.63,92.76 7.11,92.76 6.88,93 USB1.A6
$1N498: length 2
  Bottom Layer w0.254: R3.2 8.12,48.72 U2.5
$1N559: length 1.9
  Bottom Layer w0.254: LED13.2 R1.2
$1N577: length 18.5
  Bottom Layer w0.254: 4.13,48.76 2.29,46.91 2.29,35.86 LED13.1 ; 4.13,48.76 U2.1 ; 4.13,48.76 R2.2
$1N1367: length 12.1
  Top Layer w0.254: LED5.4 5.49,31.7 8.5,34.71 LED4.2
$1N1526: length 12.1
  Top Layer w0.254: LED3.4 5.5,62.32 8.25,65.08 8.25,69.42 LED2.2
$1N1539: length 12.1
  Top Layer w0.254: LED3.2 8.5,51.1 5.5,48.1 LED4.4
$1N1823: length 25.2
  Bottom Layer w0.254: LED8.4 7.55,74.66 3.18,70.28 3.18,55.17 4.58,53.76 LED9.2
$1N1839: length 36
  Bottom Layer w0.254: LED11.2 5.5,20.46 6.48,19.48 11.56,19.48 13.08,21.01 13.08,41.83 12.06,42.85 8.51,42.85 LED10.4
$1N1846: length 34
  Bottom Layer w0.254: LED9.4 8.54,58.72 11.43,58.72 13.08,57.07 13.08,46.66 11.43,45.01 4.83,45.01 3.18,43.36 3.18,39.17 4.48,37.86 LED10.2
$1N1960: length 18.6
  Top Layer w0.254: LED1.2 10.12,85.56 12.19,83.49 12.19,78.54 10.67,77.01 6.48,77.01 5.5,76.04 LED2.4
$1N2043: length 36
  Bottom Layer w0.254: LED8.2 5.5,68.34 6.1,67.74 12.32,67.74 13.46,68.89 13.46,89.46 12.32,90.6 8.54,90.6 LED7.4
$1N3699: length 10.6
  Bottom Layer w0.254: R6.2 1.52,92.63 1.52,95.43 2.16,96.06 4.44,96.06 5.88,94.63 USB1.A5
$1N3708: length 10.6
  Bottom Layer w0.254: USB1.B5 8.88,95.29 9.78,96.19 11.94,96.19 12.7,95.43 12.7,92.62 R5.2
$1N6521: length 12.1
  Top Layer w0.254: LED5.2 8.49,21.6 5.5,18.62 LED6.4
$1N6607: length 5
  Top Layer w0.254: v1(8.5,9.83) LED6.2
  Bottom Layer w0.254: v1(8.5,9.83) LED12.4
$1N6709: length 25.2
  Bottom Layer w0.254: LED11.4 7.73,26.96 3.18,22.4 3.18,7.29 4.41,6.06 LED12.2

## Copper pours and planes (outline as drawn; the poured copper is in the pictures)
GND on Top Layer: 0,100 14,100 14,0 0,0
GND on Bottom Layer: 0,100 14,100 14,0 0,0

## Text on the board
Top Silkscreen Layer: TX | RX | GND | +

# Board PCB2
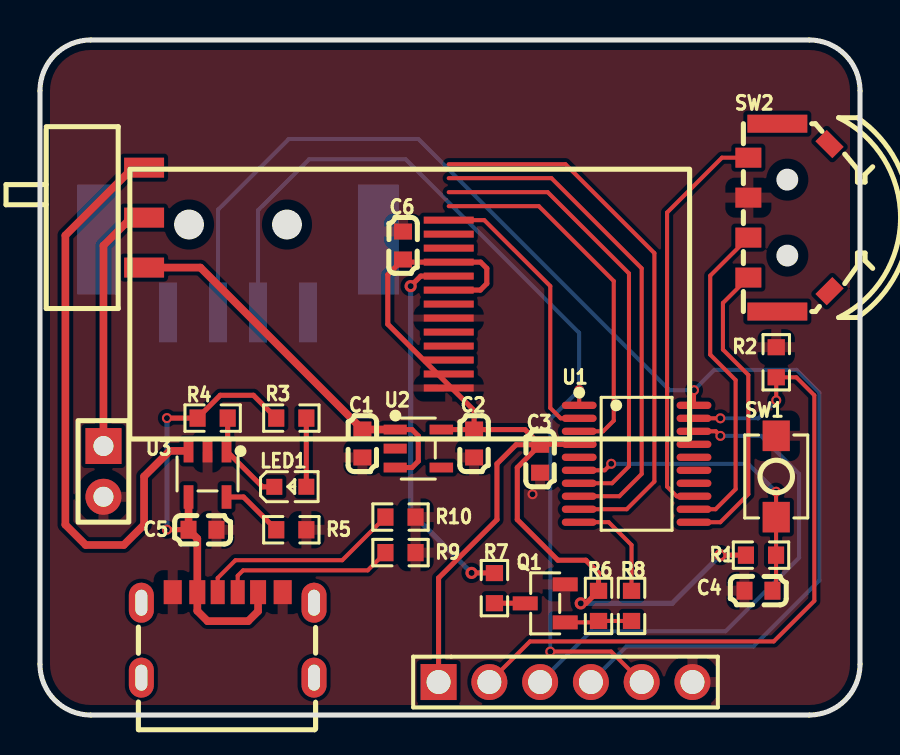
[diagram p4: board, top side]
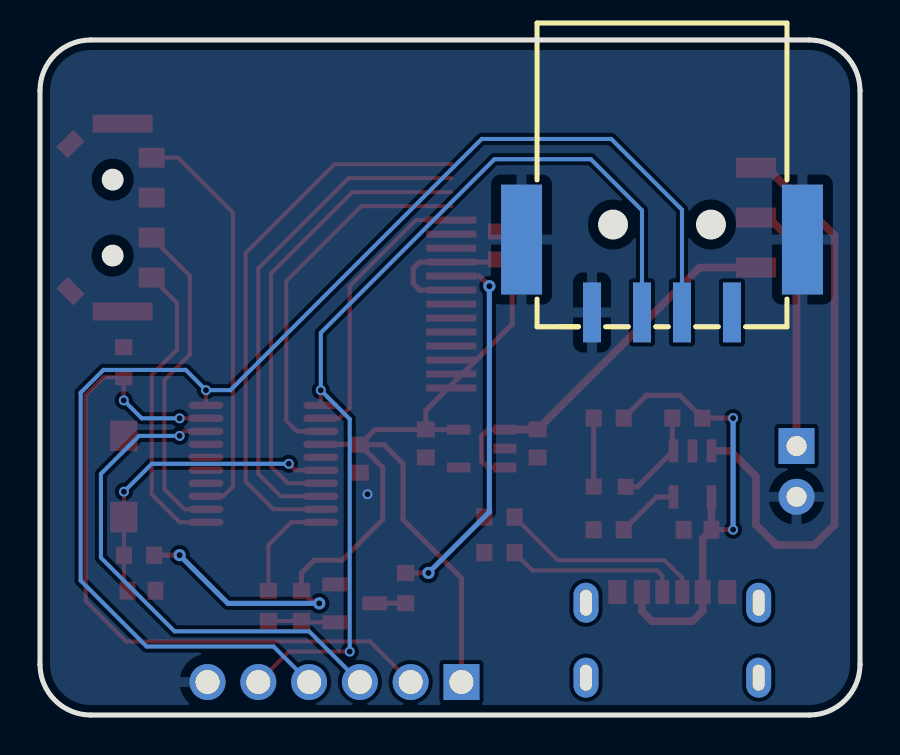
[diagram p5: board, bottom side, seen from below]

Outline 41.02 x 33.78 mm; copper layers: Top Layer, Bottom Layer. Coordinates in mm from the lower left corner of the outline.
Outline path: 0,31.24 0,2.54 arc(0.74,0.74) 2.54,0 38.48,0 arc(40.28,0.74) 41.02,2.54 41.02,31.24 arc(40.28,33.04) 38.48,33.78 2.54,33.78 arc(0.74,33.04) 0,31.24
Stack: Top Layer 0.035mm / Dielectric1 1.51mm FR4 er 4.5 / Bottom Layer 0.035mm

## Design rules (mm)
template: 自定义配置
spacing copperThickness1oz (default): track to track 0.102, other pairs 0.152 to 0.3
spacing copperThickness2oz: track to track 0.203, other pairs 0.152 to 0.3
track width copperThickness1oz (default): min 0.127, default 0.254, max 2.54
track width copperThickness2oz: min 0.203, default 0.254, max 2.54
differential pair differentialPair (default): width min 0.127, default 0.254, max 2.54; gap min 0.152, default 0.152
via viaSize (default): diameter min 0.5, default 0.61, max 10; hole min 0.3, default 0.305, max 6.3

## Placement (name value [footprint] x y rotation side)
C1  1uF  [C0603]  16.13 13.59 90 top
C2  1uF  [C0603]  21.72 13.59 90 top
C3  100nF  [C0603]  25.02 12.83 90 top
C4  100nF  [C0603]  35.94 6.22 0 top
C5  1uF  [C0603]  8.13 9.27 180 top
C6  100nF  [C0603]  18.16 23.49 270 top
H1  -  [HDR-TH_6P-P2.54-V-M-1]  26.29 1.65 0 top
H2  -  [HDR-TH_2P-P2.54-V-M-1]  3.18 12.19 270 top
LED1  -  [LED_0603]  12.57 11.43 0 top
Q1  S8050  [SOT-23-3_L2.9-W1.3-P1.90-LS2.4-BR]  25.27 5.59 0 top
R1  10K  [R0603]  36.07 8 0 top
R2  100K  [R0603]  36.83 17.65 90 top
R3  1K  [R0603]  12.57 14.86 0 top
R4  10K  [R0603]  8.64 14.86 0 top
R5  1.5K  [R0603]  12.57 9.27 180 top
R6  10K  [R0603]  27.94 5.46 90 top
R7  10R  [R0603]  22.73 6.35 90 top
R8  1K  [R0603]  29.59 5.46 270 top
R9  5.1K  [R0603]  18.03 8.13 180 top
R10  5.1K  [R0603]  18.03 9.91 0 top
SW1  -  [Key_SMD_3x4x2]  36.83 11.94 90 top
SW2  TM-2024A  [SW-SMD_TM-2024A]  37.47 24.89 270 top
SW3  SK-3245S-L1-A  [SW-SMD_SK-3245S-L1-A-1]  5.21 24.89 90 top
U1  STM32G030F6P6  [TSSOP-20_L6.5-W4.4-P0.65-LS6.4-BL]  29.84 12.57 270 top
U2  RT9013-33GB  [SOT-23-5_L3.0-W1.7-P0.95-LS2.8-BL]  18.92 13.33 270 top
U3  LTC4054  [SOT-23-5_L3.0-W1.7-P0.95-LS2.8-BL]  8.38 12.06 180 top
U4  -  [N096-1608TBBIG11-H13]  20.45 24.77 0 top
USB1  USB-234-BCW  [USB-A-SMD_USB-234-BCW]  9.91 21.97 0 bottom
USB2  -  [USB_ TYPE-C-6P]  9.26 4.01 0 top

## Footprints (pads in the part's own frame, mm; a bottom-side part is the same pattern mirrored in y, then rotated)
C0603
  rect 0.8x0.9 smd: 1(-0.7,0) 2(0.7,0)
HDR-TH_2P-P2.54-V-M-1
  rect 1.8x1.8 hole 1: 1(-1.27,0)
  round 1.8 hole 1: 2(1.27,0)
HDR-TH_6P-P2.54-V-M-1
  rect 1.8x1.8 hole 1.2: 1(-6.35,0)
  round 1.8 hole 1.2: 2(-3.81,0) 3(-1.27,0) 4(1.27,0) 5(3.81,0) 6(6.35,0)
Key_SMD_3x4x2
  rect 1.53x1.36 smd: 1(-2.035,0) 2(2.035,0)
LED_0603
  rect 0.8x0.8 smd: 1(-0.851,-0.01) 2(0.75,-0.005)
N096-1608TBBIG11-H13
  rect 2.5x0.35 smd: 1(0,0) 2(0,-0.7) 3(0,-1.4) 4(0,-2.1) 5(0,-2.8) 6(0,-3.5) 7(0,-4.2) 8(0,-4.9) 9(0,-5.6) 10(0,-6.3) 11(0,-7) 12(0,-7.7) 13(0,-8.4)
R0603
  rect 0.806x0.864 smd: 1(-0.753,0) 2(0.753,0)
SOT-23-3_L2.9-W1.3-P1.90-LS2.4-BR
  rect 1.25x0.7 smd: 1(1,-0.95) 2(1,0.95) 3(-1,0)
SOT-23-5_L3.0-W1.7-P0.95-LS2.8-BL
  rect 0.49x1.157 smd: 1(-0.95,-1.153) 2(0,-1.153) 3(0.95,-1.153)
  rect 0.49x1.175 smd: 4(0.95,1.153) 5(-0.95,1.153)
SW-SMD_SK-3245S-L1-A-1
  rect 1x2 smd: 1(-2.5,0) 2(0,0) 3(2.5,0)
SW-SMD_TM-2024A
  rect 1x1.3 smd: 1(-3,-2.03) 2(3,-2.03) 3(-1,-2.03) 4(1,-2.03)
  rect 0.9x3 smd: 5(-4.7,-0.58) 6(4.7,-0.58)
  rect 1.2x0.8 smd rot 45: 7(-3.68,2.03)
  rect 1.2x0.8 smd rot 135: 8(3.68,2.03)
TSSOP-20_L6.5-W4.4-P0.65-LS6.4-BL
  oval 0.364x1.742 smd: 1(-2.925,-2.871) 2(-2.275,-2.871) 3(-1.625,-2.871) 4(-0.975,-2.871) 5(-0.325,-2.871) 6(0.325,-2.871) 7(0.975,-2.871) 8(1.625,-2.871) 9(2.275,-2.871) 10(2.925,-2.871) 11(2.925,2.871) 12(2.275,2.871) 13(1.625,2.871) 14(0.975,2.871) 15(0.325,2.871) 16(-0.325,2.871) 17(-0.975,2.871) 18(-1.625,2.871) 19(-2.275,2.871) 20(-2.925,2.871)
USB-A-SMD_USB-234-BCW
  rect 0.9x3 smd: 1(-3.5,1.825) 2(-1,1.825) 3(1,1.825) 4(3.5,1.825)
  rect 2.05x5.5 smd: 5(-7.025,-1.825) 6(7.025,-1.825)
USB_ TYPE-C-6P
  oval 1.25x2 hole 0.6x1.3: 7(-4.193,1.611) 8(4.447,1.611) 9(-4.193,-2.139) 10(4.447,-2.139)
  rect 0.7x1.2 smd: A5(-0.373,2.139) B5(0.627,2.139)
  rect 0.8x1.2 smd: A9(1.647,2.139) B9(-1.393,2.139)
  rect 0.9x1.2 smd: A12(2.877,2.139) B12(-2.623,2.139)

## Nets
As in the schematic.

Pads without a net: SW2 5 6 7 8; U1 14 15 16 17; U2 4; U4 1 2 9; USB1 1; USB2 7 8 9 10

## Via types
v1: diameter 0.5, hole 0.3, Top Layer to Bottom Layer, 11 vias
v2: diameter 0.61, hole 0.305, Top Layer to Bottom Layer, 4 vias

## Routing (per net, layer and track width the routed paths; a pad name or vN(x,y) marks a point on that pad's centre or on a via; arc(x,y) is an arc through that point)
+5V: length 23.4
  Top Layer w0.254: 7.43,9.27 v1(6.35,9.27) ; v1(6.35,14.86) R4.1 7.88,14.87 9.02,16 10.68,16 R3.1
  Top Layer w0.381: U3.4 7.43,9.27 C5.2 7.87,8.83 USB2.B9 7.87,5.21 8.38,4.7 10.41,4.7 10.91,5.19 USB2.A9
  Bottom Layer w0.254: v1(6.35,9.27) v1(6.35,14.86)
GND:
  vias: v1(24.64,11.05)
VBAT: length 19.8
  Top Layer w0.254: U2.1 18.61,14.28 18.92,13.97 18.92,12.7 18.61,12.38 U2.3
  Top Layer w0.381: SW3.1 8.03,22.39 C1.2 17.77,14.29 U2.1
VCC: length 60.4
  Top Layer w0.254: C3.2 24.26,14.28 21.71,14.28 ; C3.2 23.81,13.53 22.86,12.57 22.86,9.78 19.94,6.86 H1.1 ; C3.2 23.88,12.38 23.88,9.78 25.91,7.75 27.31,7.75 27.94,7.11 R6.2 27.31,5.59 v2(27.05,5.59) ; C3.2 25.04,13.55 U1.4 ; 20.45,21.27 22.03,21.27 22.35,21.59 22.35,22.35 22.04,22.66 20.45,22.66 18.29,22.66 C6.2 17.4,22.03 17.4,19.56 21.72,15.24 C2.2 21.71,14.28 ; 21.71,14.28 U2.5 ; v2(34.04,8) R1.1
  Bottom Layer w0.254: v2(27.05,5.59) 31.62,5.59 v2(34.04,8)
IPS_BLK: length 5.4
  Top Layer w0.203: R8.1 29.59,8.51 28.45,9.65 26.98,9.65 U1.10
IPS_CS: length 14.2
  Top Layer w0.203: 20.45,24.77 22.22,24.77 25.53,21.46 25.53,15.37 26.05,14.85 U1.2
IPS_DC: length 23.2
  Top Layer w0.203: U1.7 28.62,11.6 29.46,12.45 29.46,22.1 25.4,26.16 20.45,26.16
IPS_RES: length 18.7
  Top Layer w0.203: U1.3 28.17,14.2 28.7,14.73 28.7,21.72 24.95,25.47 20.45,25.47
IPS_SCL: length 25.4
  Top Layer w0.203: U1.8 28.98,10.95 30.1,12.06 30.1,22.35 25.59,26.86 20.45,26.86
IPS_SDA: length 27.9
  Top Layer w0.203: 20.45,27.56 26.28,27.56 30.73,23.11 30.73,11.68 29.35,10.3 U1.9
MCU_NRST: length 15.6
  Top Layer w0.203: 36.82,9.89 R1.2 36.82,6.4 C4.2 ; 36.82,9.89 v1(36.82,11.18) ; 36.82,9.89 36.83,9.9 ; U1.6 28.25,12.25 v1(28.57,12.57)
  Bottom Layer w0.203: v1(28.57,12.57) 35.42,12.57 v1(36.82,11.18)
SW_DN: length 15.2
  Top Layer w0.203: SW2.2 34.16,20.62 34.16,18.29 35.44,17.02 35.44,11.05 34.03,9.65 U1.11
SW_OK: length 16.4
  Top Layer w0.203: U1.12 33.79,10.3 34.8,11.3 34.8,16.76 33.53,18.03 33.53,21.99 SW2.4
SW_UP: length 20.5
  Top Layer w0.203: SW2.1 34.12,27.89 31.37,25.15 31.37,11.43 31.85,10.95 U1.13
SWCLK: length 36.1
  Top Layer w0.203: 22.48,1.65 24.51,3.68 36.7,3.68 38.74,5.72 38.74,16 37.84,16.9 R2.1 v1(36.83,15.75) ; U1.19 v1(34.04,14.85)
  Bottom Layer w0.203: v1(36.83,15.75) 35.93,14.85 v1(34.04,14.85)
SWDIO: length 25.9
  Top Layer w0.203: U1.18 33.81,14.2 v1(34.04,13.97)
  Bottom Layer w0.203: 25.02,1.65 27.56,4.19 34.29,4.19 37.97,7.87 37.97,12.06 36.07,13.97 v1(34.04,13.97)
UART_RX: length 48.3
  Top Layer w0.203: H1.5 28.57,3.17 v1(25.53,3.17) ; U1.1 v1(26.97,16.26)
  Bottom Layer w0.203: v1(25.53,3.17) 25.53,14.81 v1(26.97,16.26) 26.97,19.13 18.29,27.81 13.46,27.81 10.91,25.26 USB1.3
UART_TX: length 66.5
  Top Layer w0.203: v1(32.72,16.26) U1.20
  Bottom Layer w0.203: H1.4 29.34,3.43 35.69,3.43 38.99,6.73 38.99,16.13 37.85,17.27 33.73,17.27 v1(32.72,16.26) 31.5,16.26 18.92,28.83 12.45,28.83 8.91,25.29 USB1.2
$1N438: length 1.5
  Top Layer w0.254: Q1.3 24.26,5.6 R7.1
$1N441: length 18.9
  Top Layer w0.254: 20.45,21.97 19.04,21.97 v2(18.54,21.46) ; R7.2 22.72,7.11 v2(21.59,7.11)
  Bottom Layer w0.254: v2(18.54,21.46) 18.54,10.16 v2(21.59,7.11)
$1N3309: length 3.3
  Top Layer w0.203: R8.2 R6.1 27.87,4.64 Q1.1
$1N4191: length 8.7
  Top Layer w0.203: USB2.B5 9.89,6.97 10.16,7.24 16.39,7.24 R9.2
$1N4196: length 10.4
  Top Layer w0.203: USB2.A5 8.89,6.86 9.78,7.75 15.12,7.75 R10.1
$1N5747: length 29.8
  Top Layer w0.381: SW3.3 4.66,27.39 1.27,24 1.27,9.52 2.29,8.51 4.19,8.51 5.21,9.52 5.21,11.94 6.49,13.22 U3.3
$1N5751: length 3.2
  Top Layer w0.254: R5.2 10.18,10.91 U3.5
$1N5752: length 3.4
  Top Layer w0.254: LED1.2 13.32,14.85 R3.2
$1N5753: length 4.8
  Top Layer w0.254: LED1.1 11.13,11.42 U3.1 9.39,13.28 R4.2
$1N5756: length 12.6
  Top Layer w0.381: H2.1 3.18,23.49 4.57,24.89 SW3.2

## Copper pours and planes (outline as drawn; the poured copper is in the pictures)
GND on Top Layer: 0,33.78 41.02,33.78 41.02,0 0,0
GND on Bottom Layer: 0,33.78 41.02,33.78 41.02,0 0,0
